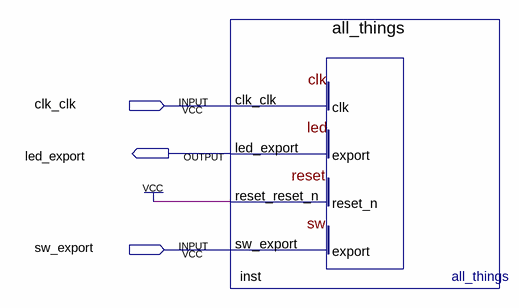
[diagram p0: schematic sheet]
// Quartus schematic console_ip.bdf as structural Verilog: 1 symbols, 3 pins
module console_ip (
  input  clk_clk,
  input  sw_export,
  output led_export
);

  all_things inst (.clk_clk(clk_clk), .reset_reset_n(1'b1), .sw_export(sw_export), .led_export(led_export));
endmodule
